# Altium schematic sheet SignalsInOut.SchDoc
size A; SheetNumber: 4; SheetTotal: 4
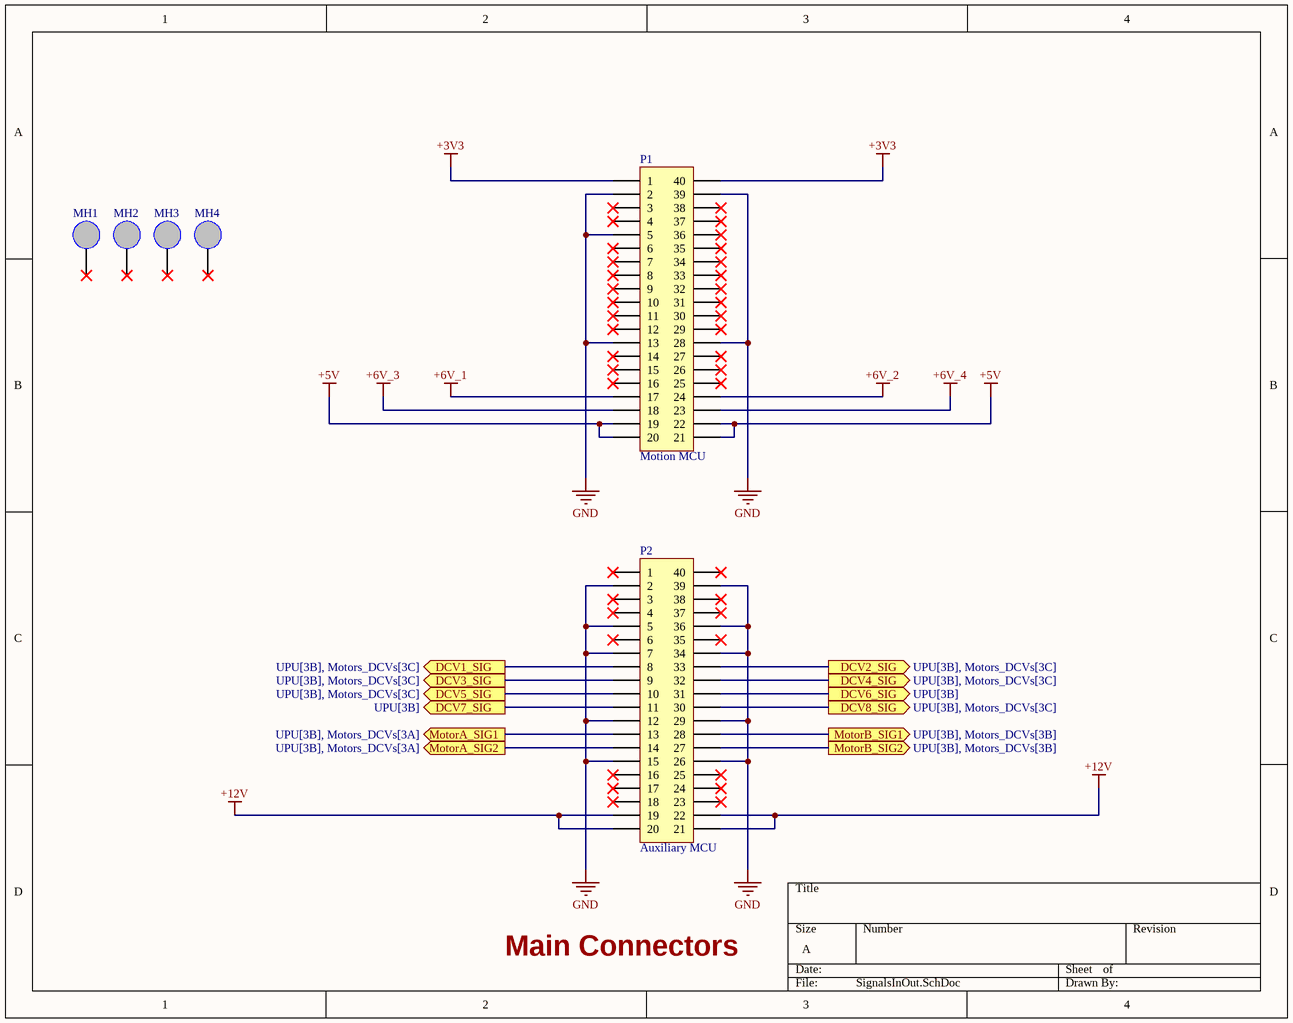
[diagram p0: SignalsInOut.SchDoc]

## Parts
MH1  Mounting Hole 3.5mm  [Connector Mounting hole TH 3.5mm]  (value not drawn)  (no BOM)
MH2  Mounting Hole 3.5mm  [Connector Mounting hole TH 3.5mm]  (value not drawn)  (no BOM)
MH3  Mounting Hole 3.5mm  [Connector Mounting hole TH 3.5mm]  (value not drawn)  (no BOM)
MH4  Mounting Hole 3.5mm  [Connector Mounting hole TH 3.5mm]  (value not drawn)  (no BOM)
P1  Motion MCU  [Header F 2.54_2X20]
P2  Auxiliary MCU  [Header F 2.54_2X20]

## Ports
DCV1_SIG (out, see UPU[3B], Motors_DCVs[3C]), DCV2_SIG (out, see UPU[3B], Motors_DCVs[3C]), DCV3_SIG (out, see UPU[3B], Motors_DCVs[3C]), DCV4_SIG (out, see UPU[3B], Motors_DCVs[3C]), DCV5_SIG (out, see UPU[3B], Motors_DCVs[3C]), DCV6_SIG (out, see UPU[3B]), DCV7_SIG (out, see UPU[3B]), DCV8_SIG (out, see UPU[3B], Motors_DCVs[3C]), MotorA_SIG1 (out, see UPU[3B], Motors_DCVs[3A]), MotorA_SIG2 (out, see UPU[3B], Motors_DCVs[3A]), MotorB_SIG1 (out, see UPU[3B], Motors_DCVs[3B]), MotorB_SIG2 (out, see UPU[3B], Motors_DCVs[3B])

## Nets
+3V3: P1.1 P1.40
+5V: P1.19 P1.20 P1.21 P1.22
+6V_1: P1.17
+6V_2: P1.24
+6V_3: P1.18
+6V_4: P1.23
+12V: P2.19 P2.20 P2.21 P2.22
GND: P1.2 P1.5 P1.13 P1.28 P1.39 P2.2 P2.5 P2.7 P2.12 P2.15 P2.26 P2.29 P2.34 P2.36 P2.39
DCV1_SIG: P2.8 ; port DCV1_SIG
DCV2_SIG: P2.33 ; port DCV2_SIG
DCV3_SIG: P2.9 ; port DCV3_SIG
DCV4_SIG: P2.32 ; port DCV4_SIG
DCV5_SIG: P2.10 ; port DCV5_SIG
DCV6_SIG: P2.31 ; port DCV6_SIG
DCV7_SIG: P2.11 ; port DCV7_SIG
DCV8_SIG: P2.30 ; port DCV8_SIG
MotorA_SIG1: P2.13 ; port MotorA_SIG1
MotorA_SIG2: P2.14 ; port MotorA_SIG2
MotorB_SIG1: P2.28 ; port MotorB_SIG1
MotorB_SIG2: P2.27 ; port MotorB_SIG2

Not connected (* = marked no-connect by the designer): MH1 1*; MH2 1*; MH3 1*; MH4 1*; P1 3* 4* 6* 7* 8* 9* 10* 11* 12* 14* 15* 16* 25* 26* 27* 29* 30* 31* 32* 33* 34* 35* 36* 37* 38*; P2 1* 3* 4* 6* 16* 17* 18* 23* 24* 25* 35* 37* 38* 40*

## Notes on the sheet
- Main Connectors

## Library data of the parts
P1 P2 = Connector Pinheader 2x20: Header_2X20; System: Connector